# EAGLE design sharpboard (EAGLE 7.2.0)
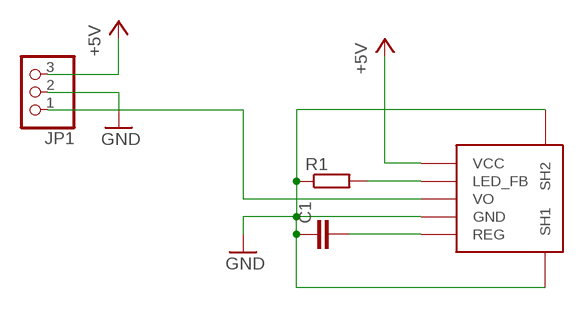
[diagram p0: schematic, sheet 1]

## Parts
C1  C-EUC0805  [C0805]
JP1  PINHD-1X3  [1X03]
R1  R-EU_R0805  [R0805]
U$2  GP2Y0D340K0F  [GP2Y0D340K0F]

## Nets
+5V: JP1.3 U$2.P$1(VCC)
GND: C1.1 JP1.2 R1.1 U$2.P$4(GND) U$2.P$6(SH1) U$2.P$7(SH2)
N$1: R1.2 U$2.P$2(LED_FB)
N$2: C1.2 U$2.P$5(REG)
N$6: JP1.1 U$2.P$3(VO)

## Library data of the parts
C1 = rcl:C-EU: CAPACITOR, European symbol
JP1 = pinhead:PINHD-1X3: PIN HEADER
R1 = rcl:R-EU_: RESISTOR, European symbol
U$2 = GP2Y0D340K0F:GP2Y0D340K0F

## Board
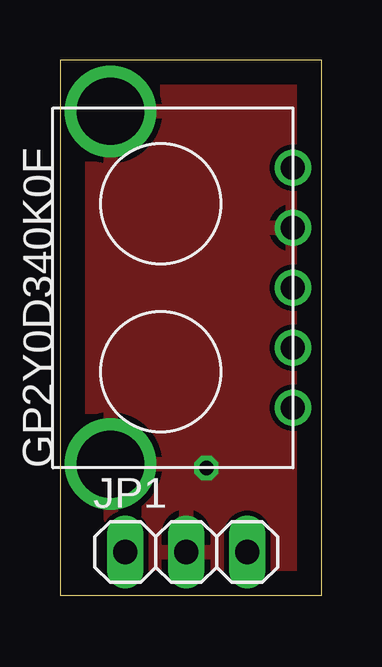
[diagram p1: board, top side]
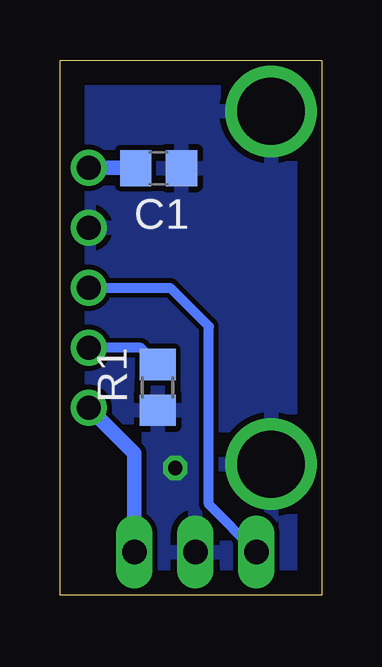
[diagram p2: board, bottom side, seen from below]

Size 10.9 x 22.3 mm. Coordinates in mm from the lower left corner, seen from the top.
Outline: 0,0 10.9,0 10.9,22.3 0,22.3 0,0
Copper layers (1*16): Top 0.035mm / dielectric 1.5mm / Bottom 0.035mm
Design rules "default": minimum track width 10mil, minimum drill 24mil, track to track 8mil, track to pad 8mil, pad to pad 8mil, via to via 8mil, smd to smd 8mil, copper to edge 40mil, drill to drill 8mil, minimum pad ring 10mil, minimum via ring 8mil, stop-mask expansion 4mil, vias tented up to drill 0mil, thermal gap 10mil

### Footprints (pad centres in the part's own frame; a part is rotated, then mirrored left to right if it is on the bottom)
C0805 = smd 1.3 x 1.5: 1 -0.95,0; 2 0.95,0
1X03 = drill 1.016 long: 1 -2.54,0; 2 0,0; 3 2.54,0
R0805 = smd 1.3 x 1.5: 1 -0.95,0; 2 0.95,0
GP2Y0D340K0F = drill 1: P$1 -4.96,-5.08; P$2 -2.46,-5.08; P$3 0.04,-5.08; P$4 2.54,-5.08; P$5 5.04,-5.08 | drill 2.8: P$6 7.39,2.52; P$7 -7.31,2.52

### Placement (x,y rotation side)
C1  6.79,17.79 180 bottom
JP1  5.26,1.8 0 top
R1  6.83,8.66 90 bottom
U$2  4.62,12.77 90 top

### Tracks (layer width: path | path; a pad name or v marks a point on that pad's centre or on a via)
+5V
  Bottom 0.61: JP1.3 7.8,5.91 U$2.P$1
GND  (via drill 0.6)
  other vias: 6.1,5.3
  pour Bottom: -1.9,23.8 -4.9,23.8 -4.9,-2.2 14.1,-2.2 14.1,23.8
  pour Top: -0.9,22.8 -3.9,22.8 -3.9,-3.2 15.1,-3.2 15.1,22.8
N$1
  Bottom 0.406: R1.2 7.53,10.31 U$2.P$2
N$2
  Bottom 0.61: U$2.P$5 8.11,17.81 8.1,17.8 C1.2
N$6
  Bottom 0.406: JP1.1 4.7,3.78 4.7,11.2 6.31,12.81 U$2.P$3